# Altium schematic sheet ControlUnit.SchDoc
size A4
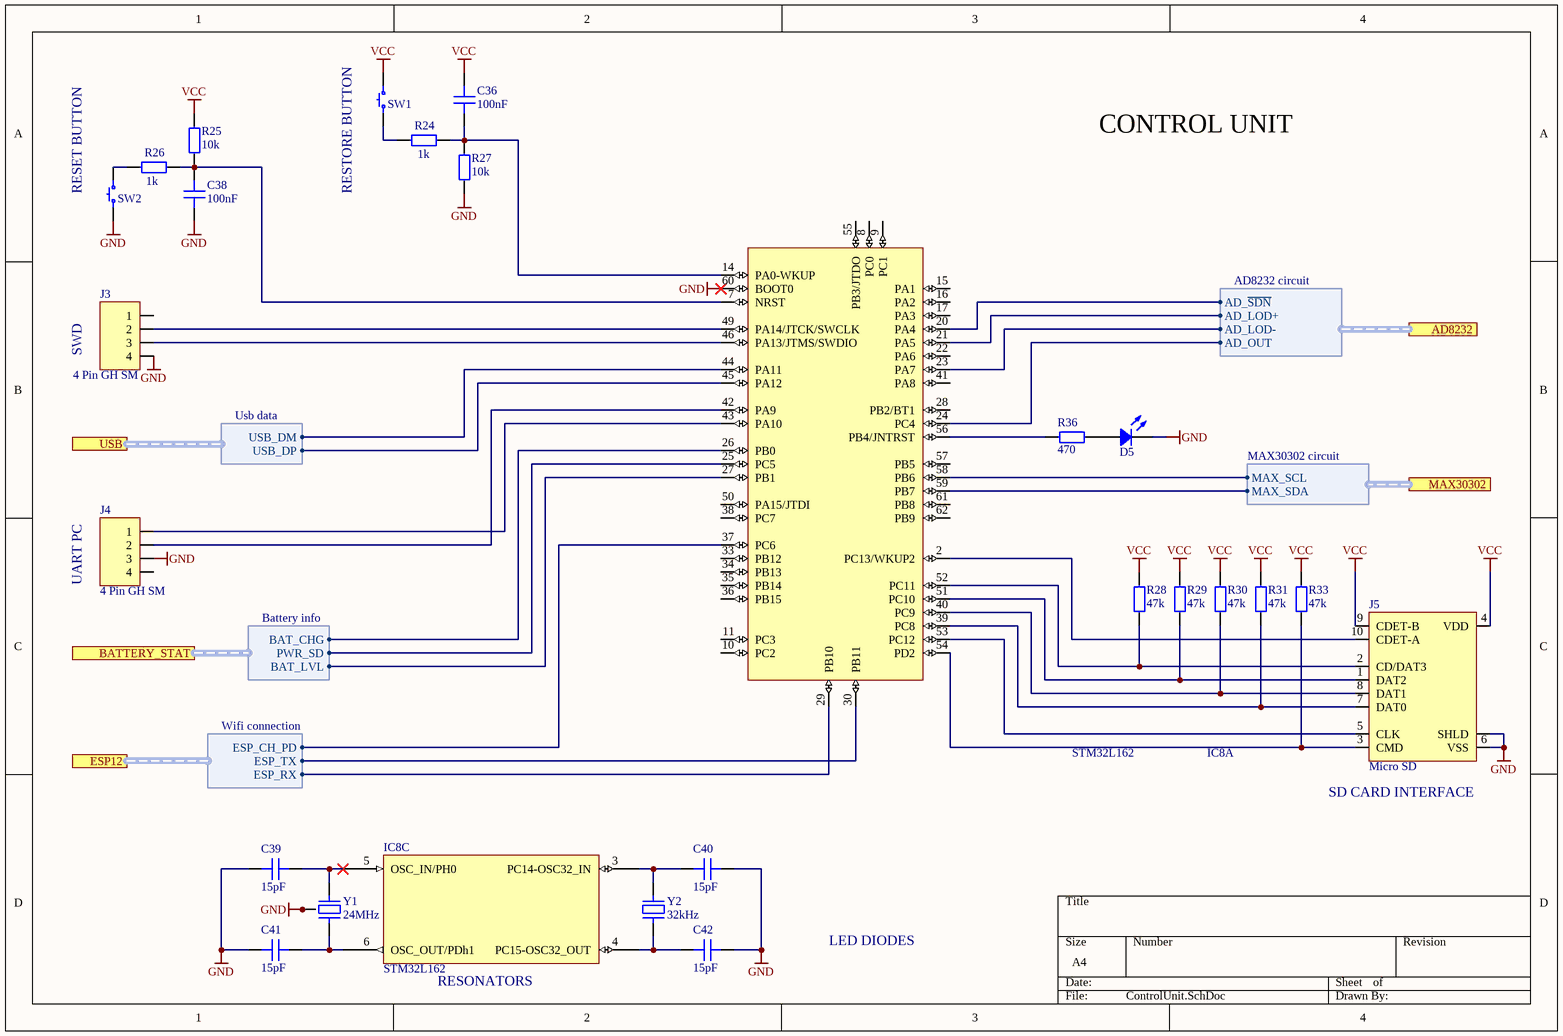
[diagram p0: ControlUnit.SchDoc]

## Parts
C36  100nF  [CAP 0603]
C38  100nF  [CAP 0603]
C39  15pF  [CAP 0603]
C40  15pF  [CAP 0603]
C41  15pF  [CAP 0603]
C42  15pF  [CAP 0603]
D5  Green  [LED 0603]  (value not drawn)
IC8  STM32L162  [LQFP64_L]  (parts A,C of 3)
J3  4 Pin GH SM  [SM04B]
J4  4 Pin GH SM  [SM04B]
J5  Micro SD  [HIROSE DM3AT-SF-PEJM5]
R24  1k  [RES 0603]
R25  10k  [RES 0603]
R26  1k  [RES 0603]
R27  10k  [RES 0603]
R28  47k  [RES 0603]
R29  47k  [RES 0603]
R30  47k  [RES 0603]
R31  47k  [RES 0603]
R33  47k  [RES 0603]
R36  470  [RES 0603]
SW1  BUTTON-NO  [SW OMRON]  (value not drawn)
SW2  BUTTON-NO  [SW OMRON]  (value not drawn)
Y1  24MHz  [RESONATOR ILCX13]
Y2  32kHz  [RESONATOR CFPX–217]

## Ports
AD8232 (harness AD8232 circuit), BATTERY_STAT (harness Battery info), ESP12 (harness Wifi connection), MAX30302 (harness MAX30302 circuit), USB (harness Usb data)

## Harnesses
Usb data: USB_DM, USB_DP
Battery info: BAT_LVL, PWR_SD, BAT_CHG
Wifi connection: ESP_CH_PD, ESP_TX, ESP_RX
MAX30302 circuit: MAX_SCL, MAX_SDA
AD8232 circuit: AD_~{SDN}, AD_LOD+, AD_LOD-, AD_OUT

## Nets
GND: C38.1 C39.1 C40.1 C41.1 C42.1 D5.2 IC8.60(BOOT0) J3.4 J4.3 J5.6(VSS) J5.S(SHLD) R27.1 SW2.2 Y1.2 Y1.4
VCC: C36.2 J5.4(VDD) J5.9(CDET-B) R25.2 R28.1 R29.1 R30.1 R31.1 R33.1 SW1.1
NetC36_1: C36.1 IC8.14(PA0-WKUP) R24.1 R27.2
NetC38_2: C38.2 IC8.7(NRST) R25.1 R26.1
NetC39_2: C39.2 IC8.5(OSC_IN/PH0) Y1.1
NetC40_2: C40.2 IC8.3(PC14-OSC32_IN) Y2.2
NetC41_2: C41.2 IC8.6(OSC_OUT/PDh1) Y1.3
NetC42_2: C42.2 IC8.4(PC15-OSC32_OUT) Y2.1
NetD5_1: D5.1 R36.1
NetIC8_2: IC8.2(PC13/WKUP2) J5.10(CDET-A)
NetIC8_20: IC8.20(PA4) ; port AD8232.AD_~{SDN}
NetIC8_21: IC8.21(PA5) ; port AD8232.AD_LOD+
NetIC8_23: IC8.23(PA7) ; port AD8232.AD_LOD-
NetIC8_24: IC8.24(PC4) ; port AD8232.AD_OUT
NetIC8_25: IC8.25(PC5) ; port BATTERY_STAT.PWR_SD
NetIC8_26: IC8.26(PB0) ; port BATTERY_STAT.BAT_CHG
NetIC8_27: IC8.27(PB1) ; port BATTERY_STAT.BAT_LVL
NetIC8_29: IC8.29(PB10) ; port ESP12.ESP_RX
NetIC8_30: IC8.30(PB11) ; port ESP12.ESP_TX
NetIC8_37: IC8.37(PC6) ; port ESP12.ESP_CH_PD
NetIC8_39: IC8.39(PC8) J5.7(DAT0) R31.2
NetIC8_40: IC8.40(PC9) J5.8(DAT1) R30.2
NetIC8_42: IC8.42(PA9) J4.2
NetIC8_43: IC8.43(PA10) J4.1
NetIC8_44: IC8.44(PA11) ; port USB.USB_DM
NetIC8_45: IC8.45(PA12) ; port USB.USB_DP
NetIC8_46: IC8.46(PA13/JTMS/SWDIO) J3.3
NetIC8_49: IC8.49(PA14/JTCK/SWCLK) J3.2
NetIC8_51: IC8.51(PC10) J5.1(DAT2) R29.2
NetIC8_52: IC8.52(PC11) J5.2(CD/DAT3) R28.2
NetIC8_53: IC8.53(PC12) J5.5(CLK)
NetIC8_54: IC8.54(PD2) J5.3(CMD) R33.2
NetIC8_56: IC8.56(PB4/JNTRST) R36.2
NetIC8_58: IC8.58(PB6) ; port MAX30302.MAX_SCL
NetIC8_59: IC8.59(PB7) ; port MAX30302.MAX_SDA
NetR24_2: R24.2 SW1.2
NetR26_2: R26.2 SW2.1

Not connected (* = marked no-connect by the designer): IC8 8(PC0) 9(PC1) 10(PC2) 11(PC3) 15(PA1) 16(PA2) 17(PA3) 22(PA6) 28(PB2/BT1) 33(PB12) 34(PB13) 35(PB14) 36(PB15) 38(PC7) 41(PA8) 50(PA15/JTDI) 55(PB3/JTDO) 57(PB5) 61(PB8) 62(PB9); J3 1; J4 4

## Notes on the sheet
- CONTROL UNIT
- (near SW2) RESET BUTTON
- (near SW1) RESTORE BUTTON
- SWD
- UART PC
- (near J5) SD CARD INTERFACE
- (near IC8) RESONATORS
- LED DIODES

## Library data of the parts
C36 C38-C42 = Capacitor: SMT Capacitor
  C36 C38: Value: 100nF
  C39-C42: Value: 15pF
D5 = LED: Chip LED; Value: Green
IC8 = STM32L162: STM32 ARM-based 32-bit MCU with 32 Kbytes Flash, 64-pin LQFP; Value: STM32L162RDT; ComponentLink1Description: http://www.st.com/content/ccc/resource/technical/document/datasheet/ee/d5/84/2b/a9/ae/44/3d/DM00039232.pdf/files/DM00039232.pdf/jcr:content/translations/en.DM00039232.pdf; ComponentLink1URL: http://www.st.com/stonline/products/literature/ds/13586.pdf; Package: LQFP64
J3 J4 = 4 Pin GH SM: Złącze GH, męskie, poziome, 4 piny, SMD
J5 = Hirose DM3 MicroSD: Micro sd card slot
R24-R31 R33 R36 = Resistor: SMDResistor
  R24 R26: Value: 1k
  R25 R27: Value: 10k
  R28-R31 R33: Value: 47k
  R36: Value: 470
SW1 SW2 = BUTTON-NO 2 PIN Small: Button, SMD, Small, 2.5x3mm
Y1 = Resonator (4pin): Resonator
Y2 = Resonator